# Altium schematic sheet GreenBox_sheet.SchDoc
size A4
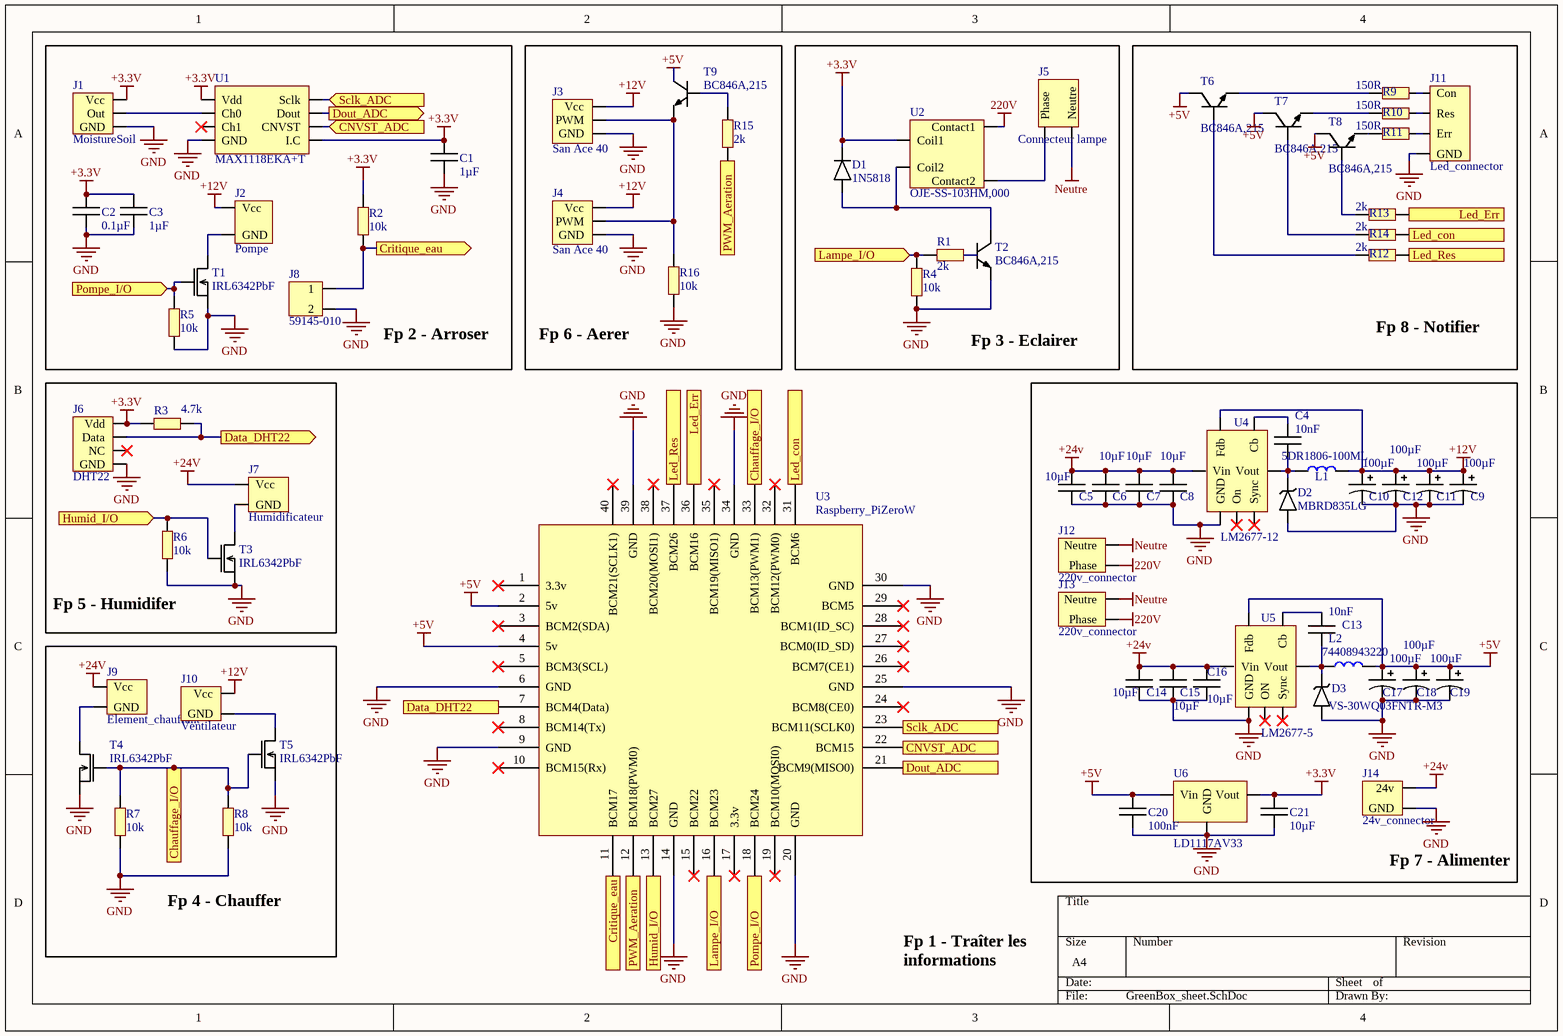
[diagram p0: GreenBox_sheet.SchDoc]

## Parts
C1  1µF  [0805]
C2  0.1µF  [0805]
C3  1µF  [0805]
C4  10nF  [0805]
C5  10µF  [0805]
C6  10µF  [0805]
C7  10µF  [0805]
C8  10µF  [0805]
C9  100µF  [Capa_polarisee]
C10  100µF  [Capa_polarisee]
C11  100µF  [Capa_polarisee]
C12  100µF  [Capa_polarisee]
C13  10nF  [0805]
C14  10µF  [0805]
C15  10µF  [0805]
C16  10µF  [0805]
C17  100µF  [Capa_polarisee]
C18  100µF  [Capa_polarisee]
C19  100µF  [Capa_polarisee]
C20  100nF  [0805]
C21  10µF  [0805]
D1  1N5818  [DO-41]
D2  MBRD835LG  [Zener12]
D3  VS-30WQ03FNTR-M3  [Zener5]
J1  MoistureSoil  [Petit_bornier_3_voies]
J2  Pompe  [Gros Bornier 2 voies]
J3  San Ace 40  [Petit_bornier_3_voies]
J4  San Ace 40  [Petit_bornier_3_voies]
J5  Connecteur lampe  [Gros Bornier 2 voies]
J6  DHT22  [Petit_bornier_4_voies]
J7  Humidificateur  [Gros Bornier 2 voies]
J8  59145-010  [Petit_bornier_2_voies]
J9  Element_chauffant  [Gros Bornier 2 voies]
J10  Ventilateur  [Petit_bornier_2_voies]
J11  Led_connector  [Petit_bornier_4_voies]
J12  220v_connector  [Gros Bornier 2 voies]
J13  220v_connector  [Gros Bornier 2 voies]
J14  24v_connector  [Gros Bornier 2 voies]
L1  5DR1806-100ML  [SDR1806-100ML]
L2  74408943220  [74408943220]
R1  2k  [0805]
R2  10k  [0805]
R3  4.7k  [0805]
R4  10k  [0805]
R5  10k  [0805]
R6  10k  [0805]
R7  10k  [0805]
R8  10k  [0805]
R9  150R  [0805]
R10  150R  [0805]
R11  150R  [0805]
R12  2k  [0805]
R13  2k  [0805]
R14  2k  [0805]
R15  2k  [0805]
R16  10k  [0805]
T1  IRL6342PbF  [SO-8]
T2  BC846A,215  [SOT-23 - duplicate]
T3  IRL6342PbF  [SO-8]
T4  IRL6342PbF  [SO-8]
T5  IRL6342PbF  [SO-8]
T6  BC846A,215  [SOT-23 - duplicate]
T7  BC846A,215  [SOT-23 - duplicate]
T8  BC846A,215  [SOT-23 - duplicate]
T9  BC846A,215  [SOT-23 - duplicate]
U1  MAX1118EKA+T  [SOT-23]
U2  OJE-SS-103HM,000  [Relai]
U3  Raspberry_PiZeroW  [Raspberry]
U4  LM2677-12  [TO-220-7 + dissipateur]
U5  LM2677-5  [TO-263]
U6  LD1117AV33  [TO-220 + Dissipateur]

## Ports
Chauffage_I/O (in), Chauffage_I/O (out), CNVST_ADC (in), CNVST_ADC (out), Critique_eau (in), Critique_eau (out), Data_DHT22 (in), Data_DHT22 (out), Dout_ADC (in), Dout_ADC (out), Humid_I/O (in), Humid_I/O (out), Lampe_I/O (in), Lampe_I/O (out), Led_con (in), Led_con (out), Led_Err (in), Led_Err (out), Led_Res (in), Led_Res (out), Pompe_I/O (in), Pompe_I/O (out), PWM_Aeration (in), PWM_Aeration (out), Sclk_ADC (in), Sclk_ADC (out)

## Nets
220V: J12.2(Phase) J13.2(Phase) U2.3(Contact1)
+3.3V: C1.1 C2.1 C3.1 C21.1 D1.2 J1.1(Vcc) J6.1(Vdd) R2.2 R3.2 U1.1(Vdd) U1.5(I.C) U2.1(Coil1) U6.3(Vout)
+5V: C17.2 C18.2 C19.2 C20.1 L2.2 T6.3 T7.3 T8.3 T9.3 U3.2(5v) U3.4(5v) U5.6(Fdb) U6.1(Vin)
+12V: C9.2 C10.2 C11.2 C12.2 J2.2(Vcc) J3.1(Vcc) J4.1(Vcc) J10.1(Vcc) L1.2 U4.6(Fdb)
+24V: C5.1 C6.1 C7.1 C8.1 C14.1 C15.1 C16.1 J7.2(Vcc) J9.2(Vcc) J14.2(24v) U4.2(Vin) U5.2(Vin)
GND: C1.2 C2.2 C3.2 C5.2 C6.2 C7.2 C8.2 C9.1 C10.1 C11.1 C12.1 C14.2 C15.2 C16.2 C17.1 C18.1 C19.1 C20.2 C21.2 D2.1 D3.1 J1.3(GND) J3.3(GND) J4.3(GND) J6.4(GND) J8.2 J11.4(GND) J14.1(GND) R4.1 R5.1 R6.1 R7.1 R8.1 R16.1 T1.1 T2.2 T3.1 T4.1 T5.1 U1.4(GND) U3.6(GND) U3.9(GND) U3.14(GND) U3.20(GND) U3.25(GND) U3.30(GND) U3.34(GND) U3.39(GND) U4.4(GND) U5.4(GND) U6.2(GND)
Neutre: J5.1(Neutre) J12.1(Neutre) J13.1(Neutre)
Chauffage_I/O: R7.2 R8.2 T4.4 T5.4 U3.33(BCM13(PWM1)) ; port Chauffage_I/O
CNVST_ADC: U1.6(CNVST) U3.22(BCM15) ; port CNVST_ADC
Critique_eau: J8.1 R2.1 U3.11(BCM17) ; port Critique_eau
Data_DHT22: J6.2(Data) R3.1 U3.7(BCM4(Data)) ; port Data_DHT22
Dout_ADC: U1.7(Dout) U3.21(BCM9(MISO0)) ; port Dout_ADC
Humid_I/O: R6.2 T3.4 U3.13(BCM27) ; port Humid_I/O
Lampe_I/O: R1.1 R4.2 U3.16(BCM23) ; port Lampe_I/O
Led_con: R14.1 U3.31(BCM6) ; port Led_con
Led_Err: R13.1 U3.36(BCM16) ; port Led_Err
Led_Res: R12.1 U3.37(BCM26) ; port Led_Res
Pompe_I/O: R5.2 T1.4 U3.18(BCM24) ; port Pompe_I/O
PWM_Aeration: R15.2 U3.12(BCM18(PWM0)) ; port PWM_Aeration
Sclk_ADC: U1.8(Sclk) U3.23(BCM11(SCLK0)) ; port Sclk_ADC
NetC4_1: C4.1 D2.2 L1.1 U4.1(Vout)
NetC4_2: C4.2 U4.3(Cb)
NetC13_1: C13.1 D3.2 L2.1 U5.1(Vout)
NetC13_2: C13.2 U5.3(Cb)
NetD1_1: D1.1 T2.3 U2.4(Coil2)
NetJ1_2: J1.2(Out) U1.2(Ch0)
NetJ2_1: J2.1(GND) T1.5
NetJ3_2: J3.2(PWM) J4.2(PWM) R16.2 T9.2
NetJ5_2: J5.2(Phase) U2.2(Contact2)
NetJ7_1: J7.1(GND) T3.5
NetJ9_1: J9.1(GND) T4.5
NetJ10_2: J10.2(GND) T5.5
NetJ11_1: J11.1(Con) R9.1
NetJ11_2: J11.2(Res) R10.1
NetJ11_3: J11.3(Err) R11.1
NetR1_2: R1.2 T2.1
NetR9_2: R9.2 T6.2
NetR10_2: R10.2 T7.2
NetR11_2: R11.2 T8.2
NetR12_2: R12.2 T6.1
NetR13_2: R13.2 T8.1
NetR14_2: R14.2 T7.1
NetR15_1: R15.1 T9.1

Not connected (* = marked no-connect by the designer): J6 3(NC)*; U1 3(Ch1)*; U3 1(3.3v)* 3(BCM2(SDA))* 5(BCM3(SCL))* 8(BCM14(Tx))* 10(BCM15(Rx))* 15(BCM22)* 17(3.3v)* 19(BCM10(MOSI0))* 24(BCM8(CE0))* 26(BCM7(CE1))* 27(BCM0(ID_SD))* 28(BCM1(ID_SC))* 29(BCM5)* 32(BCM12(PWM0))* 35(BCM19(MISO1))* 38(BCM20(MOSI1))* 40(BCM21(SCLK1))*; U4 5(Sync)* 7(On)*; U5 5(Sync)* 7(ON)*

## Notes on the sheet
- Fp 2 - Arroser
- (near R16) Fp 6 - Aerer
- Fp 3 - Eclairer
- Fp 8 - Notifier
- Fp 5 - Humidifer
- Fp 4 - Chauffer
- (near J14) Fp 7 - Alimenter
- Fp 1 - Traîter les
  informations

## Library data of the parts
C1-C8 C13-C16 C20 C21 = Capa_0805
C9-C12 C17-C19 = Capa_polarisee
D1 = diode
D2 = Zener-12
D3 = Zener-5
J1 = Capteur_humidite_sol: Connecteur Capteur d'humidité du sol
J2 = Pompe_connector
J3 J4 = Ventilateur_aeration
J5 = Lampe
J6 = Capteur_humidite
J8 = Capteur_reed
J9 = Element chauffant
J10 = ventilateur chauffage
J11 = Led_connecteur
J12 J13 = Connecteur_220v
J14 = Connectique_24v
L1 = Bobine-12
L2 = Bobine-5
R1-R16 = Resistance_0805
T1 T3-T5 = Mosfet
T2 T6-T9 = transistor
U1 = ADC
U2 = Relai
U3 = Raspberry
U4 = Alimentation-12v
U5 = Alimentation-5v
U6 = Alimentation-3.3v